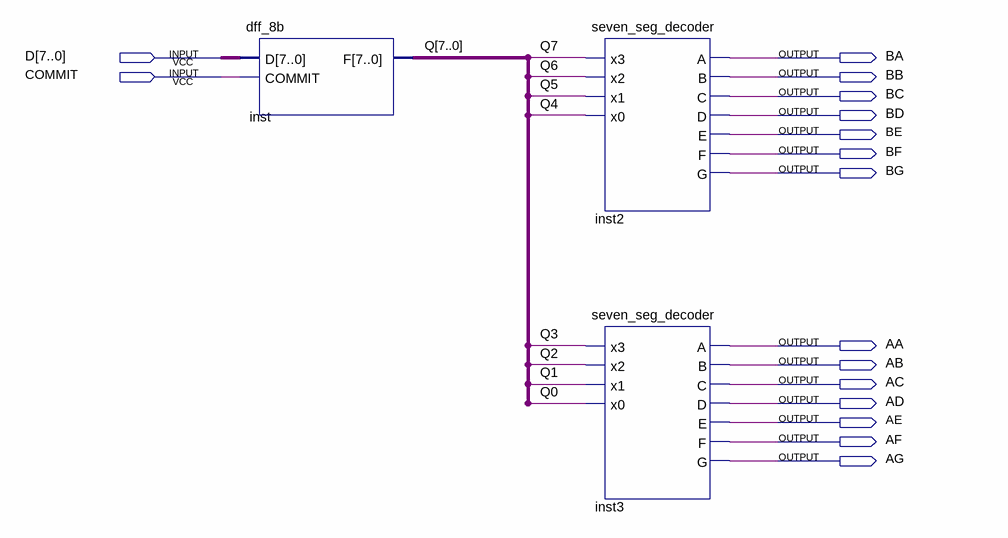
[diagram p0: schematic sheet]
// Quartus schematic seven_seg_8b.bdf as structural Verilog: 3 symbols, 16 pins
module seven_seg_8b (
  input  [7:0] D,
  input  COMMIT,
  output BA,
  output BB,
  output BC,
  output BD,
  output BE,
  output BF,
  output BG,
  output AA,
  output AB,
  output AC,
  output AD,
  output AE,
  output AF,
  output AG
);

  wire [7:0] Q;

  dff_8b inst (.D(D), .COMMIT(COMMIT), .F(Q));
  seven_seg_decoder inst2 (
    .x3(Q[7]), .x2(Q[6]), .x1(Q[5]), .x0(Q[4]), .A(BA), .B(BB), .C(BC), .D(BD), .E(BE), .F(BF), .G(BG));
  seven_seg_decoder inst3 (
    .x3(Q[3]), .x2(Q[2]), .x1(Q[1]), .x0(Q[0]), .A(AA), .B(AB), .C(AC), .D(AD), .E(AE), .F(AF), .G(AG));
endmodule
